# EAGLE schematic exixe18 (EAGLE 8.2.2)
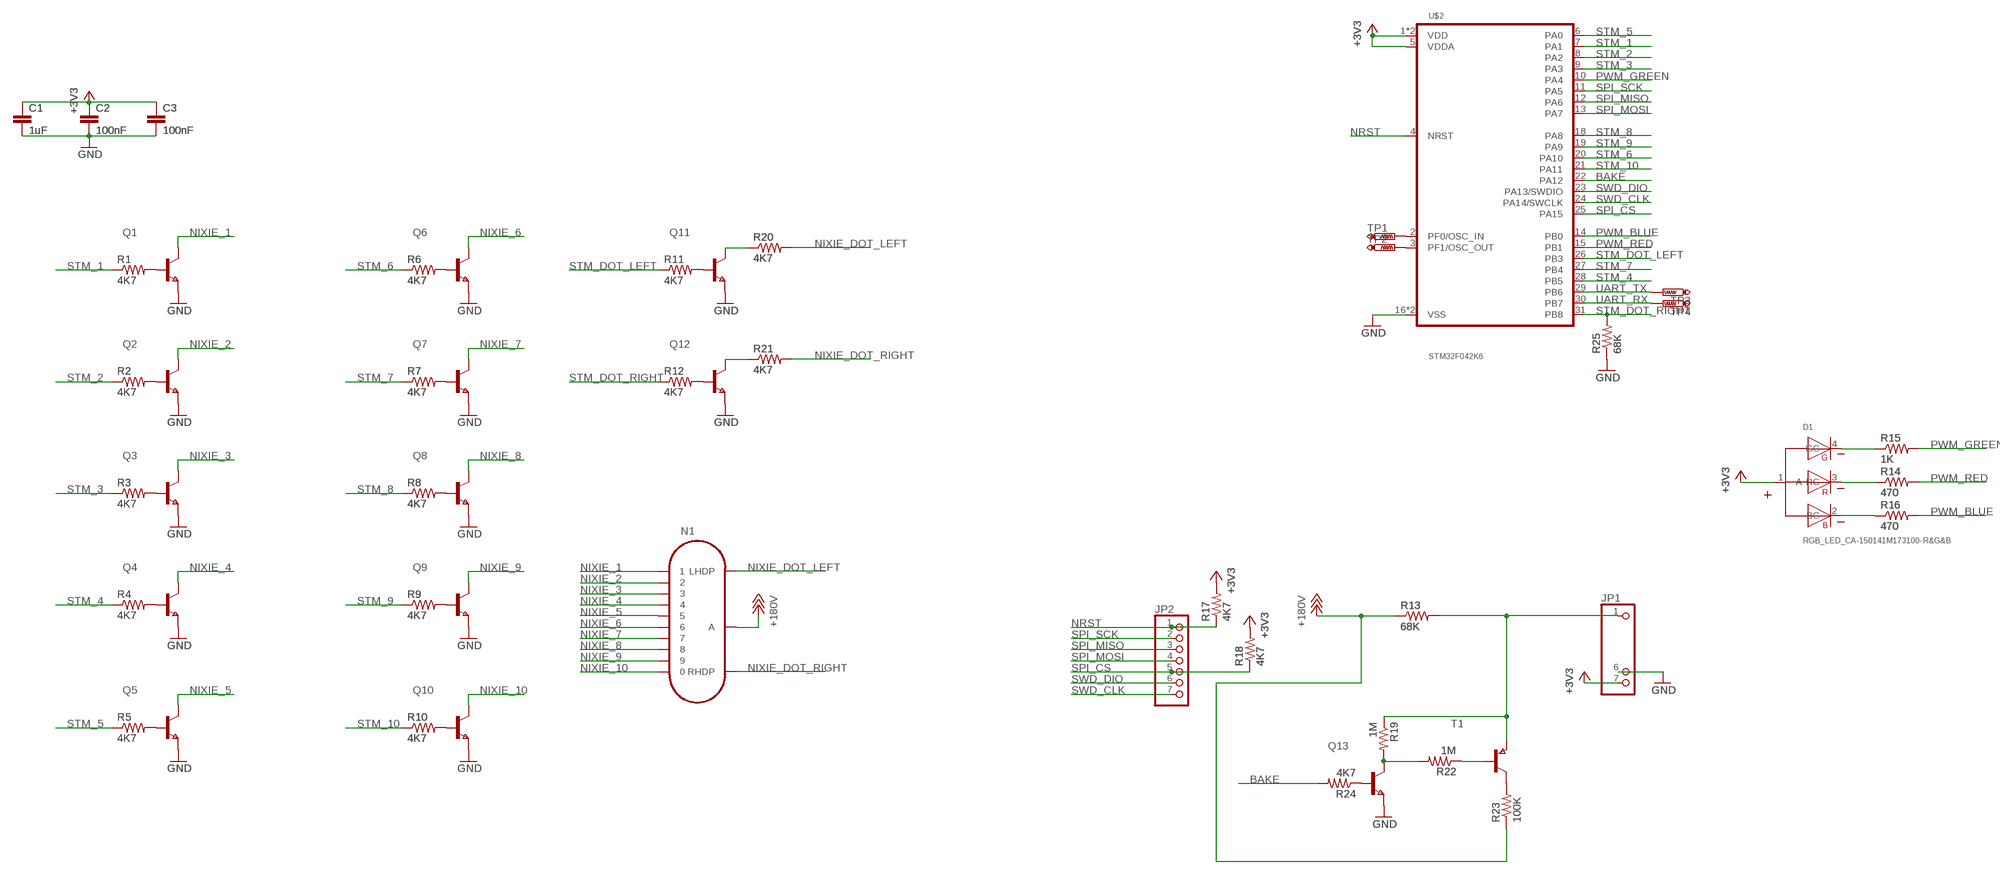
[diagram p0: schematic, sheet 1]

## Parts
C1  1uF  CAP0805  [0805]
C2  100nF  CAP0805  [0805]
C3  100nF  CAP0805  [0805]
D1  RGB_LED_CA-150141M173100-R&G&B  [3528-COMMON-ANODE]
JP1  PINHD-1X7  [1X07]
JP2  PINHD-1X7  [1X07]
N1  IN-14  [IN-14]
Q1  BF820  [SOT323]
Q2  BF820  [SOT323]
Q3  BF820  [SOT323]
Q4  BF820  [SOT323]
Q5  BF820  [SOT323]
Q6  BF820  [SOT323]
Q7  BF820  [SOT323]
Q8  BF820  [SOT323]
Q9  BF820  [SOT323]
Q10  BF820  [SOT323]
Q11  BF820  [SOT323]
Q12  BF820  [SOT323]
Q13  BF820  [SOT323]
R1  4K7  RESISTOR0805-RES  [0805]
R2  4K7  RESISTOR0805-RES  [0805]
R3  4K7  RESISTOR0805-RES  [0805]
R4  4K7  RESISTOR0805-RES  [0805]
R5  4K7  RESISTOR0805-RES  [0805]
R6  4K7  RESISTOR0805-RES  [0805]
R7  4K7  RESISTOR0805-RES  [0805]
R8  4K7  RESISTOR0805-RES  [0805]
R9  4K7  RESISTOR0805-RES  [0805]
R10  4K7  RESISTOR0805-RES  [0805]
R11  4K7  RESISTOR0805-RES  [0805]
R12  4K7  RESISTOR0805-RES  [0805]
R13  68K  RESISTOR0805-RES  [0805]
R14  470  RESISTOR0805-RES  [0805]
R15  1K  RESISTOR0805-RES  [0805]
R16  470  RESISTOR0805-RES  [0805]
R17  4K7  RESISTOR0805-RES  [0805]
R18  4K7  RESISTOR0805-RES  [0805]
R19  1M  RESISTOR0805-RES  [0805]
R20  4K7  RESISTOR0805-RES  [0805]
R21  4K7  RESISTOR0805-RES  [0805]
R22  1M  RESISTOR0805-RES  [0805]
R23  100K  RESISTOR0805-RES  [0805]
R24  4K7  RESISTOR0805-RES  [0805]
R25  68K  RESISTOR0805-RES  [0805]
T1  PNPSOT323  [SOT323]
TP1  PTR1TP13R  [TP13R]
TP2  PTR1TP13R  [TP13R]
TP3  PTR1TP13R  [TP13R]
TP4  PTR1TP13R  [TP13R]
U$2  STM32F042K6  [TQFP32-08]

## Nets
+3V3: C1.1 C2.1 C3.1 D1.1(A) JP1.7 R17.2 R18.2 U$2.1(VDD) U$2.5(VDDA) U$2.17(VDD)
+180V: N1.A R13.1 R23.1
BAKE: R24.2 U$2.22(PA12)
GND: C1.2 C2.2 C3.2 JP1.6 Q1.2(E) Q2.2(E) Q3.2(E) Q4.2(E) Q5.2(E) Q6.2(E) Q7.2(E) Q8.2(E) Q9.2(E) Q10.2(E) Q11.2(E) Q12.2(E) Q13.2(E) R25.1 U$2.16(VSS) U$2.32(VSS)
N$1: Q1.1(B) R1.2
N$2: TP1.TP U$2.2(PF0/OSC_IN)
N$3: D1.4(GC) R15.1
N$4: Q2.1(B) R2.2
N$5: Q3.1(B) R3.2
N$6: Q4.1(B) R4.2
N$7: Q5.1(B) R5.2
N$8: Q6.1(B) R6.2
N$9: Q7.1(B) R7.2
N$10: Q8.1(B) R8.2
N$11: Q9.1(B) R9.2
N$12: Q10.1(B) R10.2
N$13: Q11.1(B) R11.2
N$14: Q12.1(B) R12.2
N$15: D1.3(RC) R14.1
N$16: TP2.TP U$2.3(PF1/OSC_OUT)
N$17: Q12.3(C) R21.1
N$18: Q11.3(C) R20.1
N$19: JP1.1 R13.2 R19.1 T1.3(E)
N$20: R22.1 T1.2(B)
N$21: D1.2(BC) R16.1
N$22: Q13.3(C) R19.2 R22.2
N$23: Q13.1(B) R24.1
N$24: R23.2 T1.1(C)
NIXIE_1: N1.1 Q1.3(C)
NIXIE_2: N1.2 Q2.3(C)
NIXIE_3: N1.3 Q3.3(C)
NIXIE_4: N1.4 Q4.3(C)
NIXIE_5: N1.5 Q5.3(C)
NIXIE_6: N1.6 Q6.3(C)
NIXIE_7: N1.7 Q7.3(C)
NIXIE_8: N1.8 Q8.3(C)
NIXIE_9: N1.9 Q9.3(C)
NIXIE_10: N1.0 Q10.3(C)
NIXIE_DOT_LEFT: N1.LHDP R20.2
NIXIE_DOT_RIGHT: N1.RHDP R21.2
NRST: JP2.1 R17.1 U$2.4(NRST)
PWM_BLUE: R16.2 U$2.14(PB0)
PWM_GREEN: R15.2 U$2.10(PA4)
PWM_RED: R14.2 U$2.15(PB1)
SPI_CS: JP2.5 R18.1 U$2.25(PA15)
SPI_MISO: JP2.3 U$2.12(PA6)
SPI_MOSI: JP2.4 U$2.13(PA7)
SPI_SCK: JP2.2 U$2.11(PA5)
STM_1: R1.1 U$2.7(PA1)
STM_2: R2.1 U$2.8(PA2)
STM_3: R3.1 U$2.9(PA3)
STM_4: R4.1 U$2.28(PB5)
STM_5: R5.1 U$2.6(PA0)
STM_6: R6.1 U$2.20(PA10)
STM_7: R7.1 U$2.27(PB4)
STM_8: R8.1 U$2.18(PA8)
STM_9: R9.1 U$2.19(PA9)
STM_10: R10.1 U$2.21(PA11)
STM_DOT_LEFT: R11.1 U$2.26(PB3)
STM_DOT_RIGHT: R12.1 R25.2 U$2.31(PB8)
SWD_CLK: JP2.7 U$2.24(PA14/SWCLK)
SWD_DIO: JP2.6 U$2.23(PA13/SWDIO)
UART_RX: TP4.TP U$2.30(PB7)
UART_TX: TP3.TP U$2.29(PB6)

## Library data of the parts
C1-C3 = joyAnalog:CAP: Capacitor Standard 0603 ceramic capacitor, and 0.1" leaded capacitor.
D1 = nixx:RGB_LED_CA: SMD full-color TOP LED Characteristics Low energy consumption High reliability Low current requirement Fast switching No UV/IR radiation High brightness RGB individual control Compact package outline Black surface Applications Flash light Switch indicators Equipments indicators Accent and decorative lighting Electronic signage Video displays Backlight for LCDs, PDAs and TVs Oven, microwave Street lighting Ideal for lateral coupling in light guides <http://katalog.we-online.de/media/images/eipal/WL-SFTW_pf2.jpg> Details see: http://katalog.we-online.de/en/led/WL-SFTW?m Updated 2015-04-10 2015 (C) Wurth Elektronik
JP1 = nixx:PINHD-1X7: PIN HEADER
JP2 = pinhead:PINHD-1X7: PIN HEADER
N1 = russian-nixies:IN-14: IN-14: medium numeric frontview nixie tube
Q1-Q13 = nixx:BF820: NPN TRANSISTOR
R1-R25 = joyAnalog:RESISTOR: Resistor Basic schematic elements and footprints for 0603, 1206, and PTH resistors.
T1 = zetex:PNPSOT323: PNP TRANSISTOR; MPN: 2DB1689-7; OC_FARNELL: 1710698; OC_NEWARK: 25R5667
TP1-TP4 = testpad:PTR1: TEST PIN
U$2 = nixx:STM32F042K6